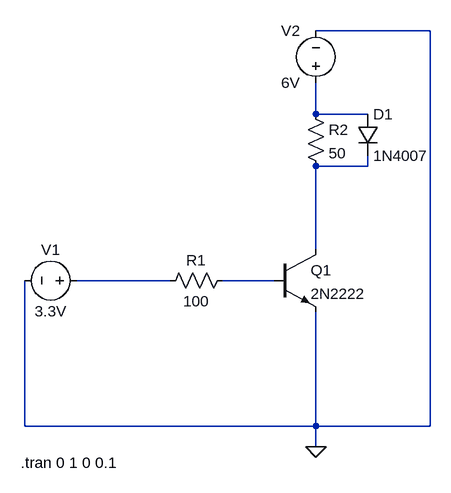
[diagram p0: schematic control.asc]
control.asc, the LTspice schematic file:
Version 4
SHEET 1 880 680
WIRE 656 -224 480 -224
WIRE 480 -96 480 -144
WIRE 560 -96 480 -96
WIRE 560 -16 560 -32
WIRE 560 -16 480 -16
WIRE 480 112 480 -16
WIRE 256 160 112 160
WIRE 416 160 336 160
WIRE 32 384 32 160
WIRE 480 384 480 208
WIRE 480 384 32 384
WIRE 656 384 656 -224
WIRE 656 384 480 384
WIRE 480 416 480 384
FLAG 480 416 0
SYMBOL voltage 128 160 R90
WINDOW 0 -32 56 VBottom 2
WINDOW 3 32 56 VTop 2
SYMATTR InstName V1
SYMATTR Value 3.3V
SYMBOL npn 416 112 R0
SYMATTR InstName Q1
SYMATTR Value 2N2222
SYMBOL res 352 144 R90
WINDOW 0 0 56 VBottom 2
WINDOW 3 32 56 VTop 2
SYMATTR InstName R1
SYMATTR Value 100
SYMBOL voltage 480 -128 R180
WINDOW 0 24 96 Left 2
WINDOW 3 24 16 Left 2
SYMATTR InstName V2
SYMATTR Value 6V
SYMBOL res 464 -112 R0
SYMATTR InstName R2
SYMATTR Value 50
SYMBOL diode 544 -96 R0
SYMATTR InstName D1
SYMATTR Value 1N4007
TEXT 26 440 Left 2 !.tran 0 1 0 0.1

The netlist it stands for:
* control.asc
V1 N003 0 3.3V
Q1 N002 N004 0 0 2N2222
R1 N004 N003 100
V2 N001 0 6V
R2 N001 N002 50
D1 N001 N002 1N4007
.model D D
.lib standard.dio
.model NPN NPN
.model PNP PNP
.lib standard.bjt
.tran 0 1 0 0.1
.backanno
.end